# EAGLE design MCP1700 (EAGLE 7.1.0)
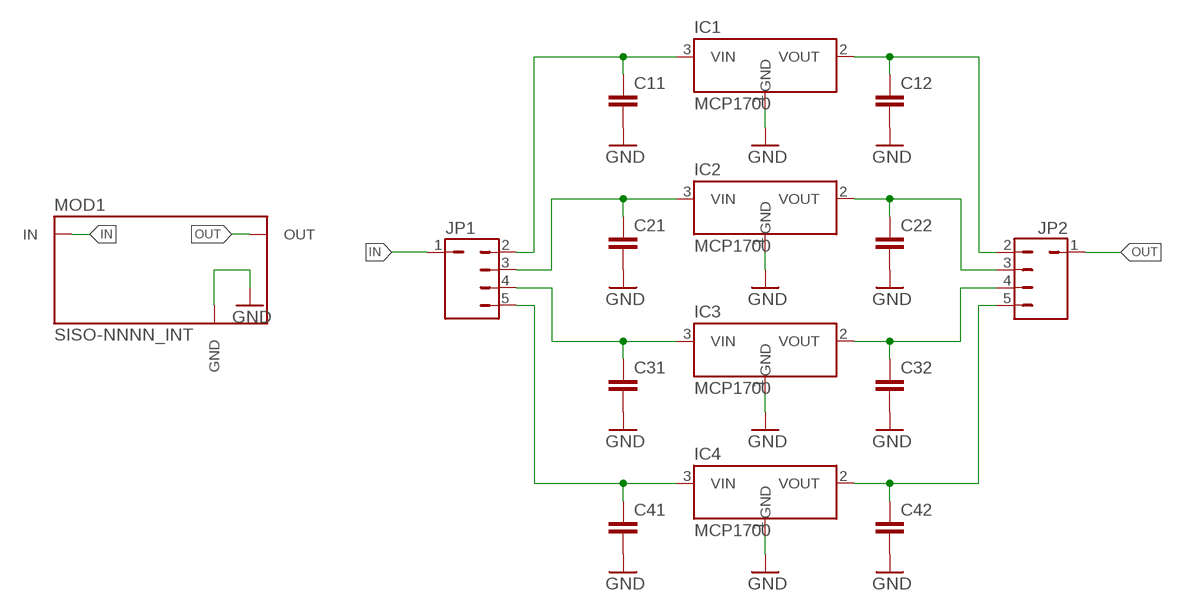
[diagram p0: schematic, sheet 1]

## Parts
C11  C-EUC0805  [C0805]
C12  C-EUC0805  [C0805]
C21  C-EUC0805  [C0805]
C22  C-EUC0805  [C0805]
C31  C-EUC0805  [C0805]
C32  C-EUC0805  [C0805]
C41  C-EUC0805  [C0805]
C42  C-EUC0805  [C0805]
IC1  MCP1700  [SOT23]
IC2  MCP1700  [SOT23]
IC3  MCP1700  [SOT23]
IC4  MCP1700  [SOT23]
JP1  JP4Q  [JP1-4]
JP2  JP4Q  [JP1-4]
MOD1  SISO-NNNN_INT  [SISO-NNNN]

## Nets
GND: C11.2 C12.2 C21.2 C22.2 C31.2 C32.2 C41.2 C42.2 IC1.1(GND) IC2.1(GND) IC3.1(GND) IC4.1(GND) MOD1.GND1(GND) MOD1.GND2(GND) MOD1.GND3(GND) MOD1.GND4(GND)
IN: JP1.1 MOD1.IN1(IN) MOD1.IN2(IN) MOD1.IN3(IN) MOD1.IN4(IN)
N$1: C11.1 IC1.3(VIN) JP1.2
N$2: C21.1 IC2.3(VIN) JP1.3
N$3: C31.1 IC3.3(VIN) JP1.4
N$4: C41.1 IC4.3(VIN) JP1.5
N$5: C12.1 IC1.2(VOUT) JP2.2
N$6: C22.1 IC2.2(VOUT) JP2.3
N$7: C32.1 IC3.2(VOUT) JP2.4
N$8: C42.1 IC4.2(VOUT) JP2.5
OUT: JP2.1 MOD1.OUT1(OUT) MOD1.OUT2(OUT) MOD1.OUT3(OUT) MOD1.OUT4(OUT)

## Library data of the parts
C11 C12 C21 C22 C31 C32 C41 C42 = rcl:C-EU: CAPACITOR, European symbol
IC1-IC4 = MCP1700:MCP1700
JP1 JP2 = Jumper_mod:JP4Q: JUMPER
MOD1 = AllModules:SISO-NNNN_INT

## Board
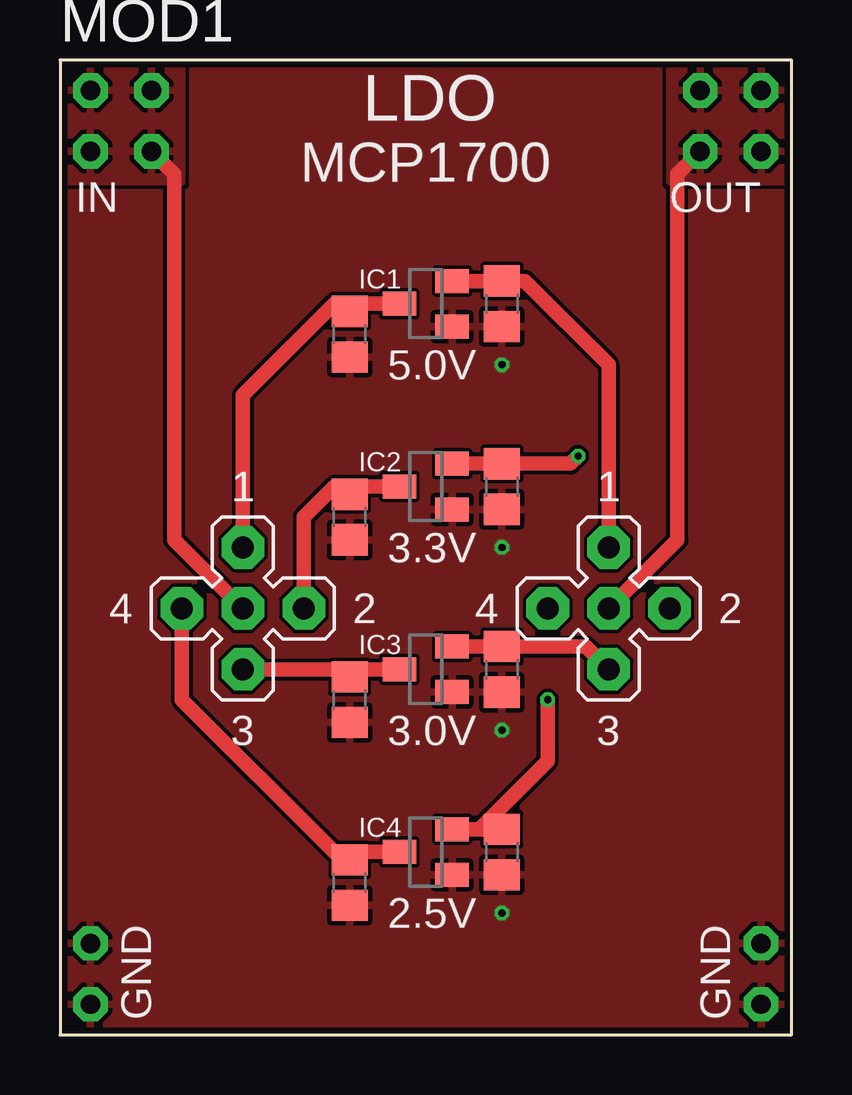
[diagram p1: board, top side]
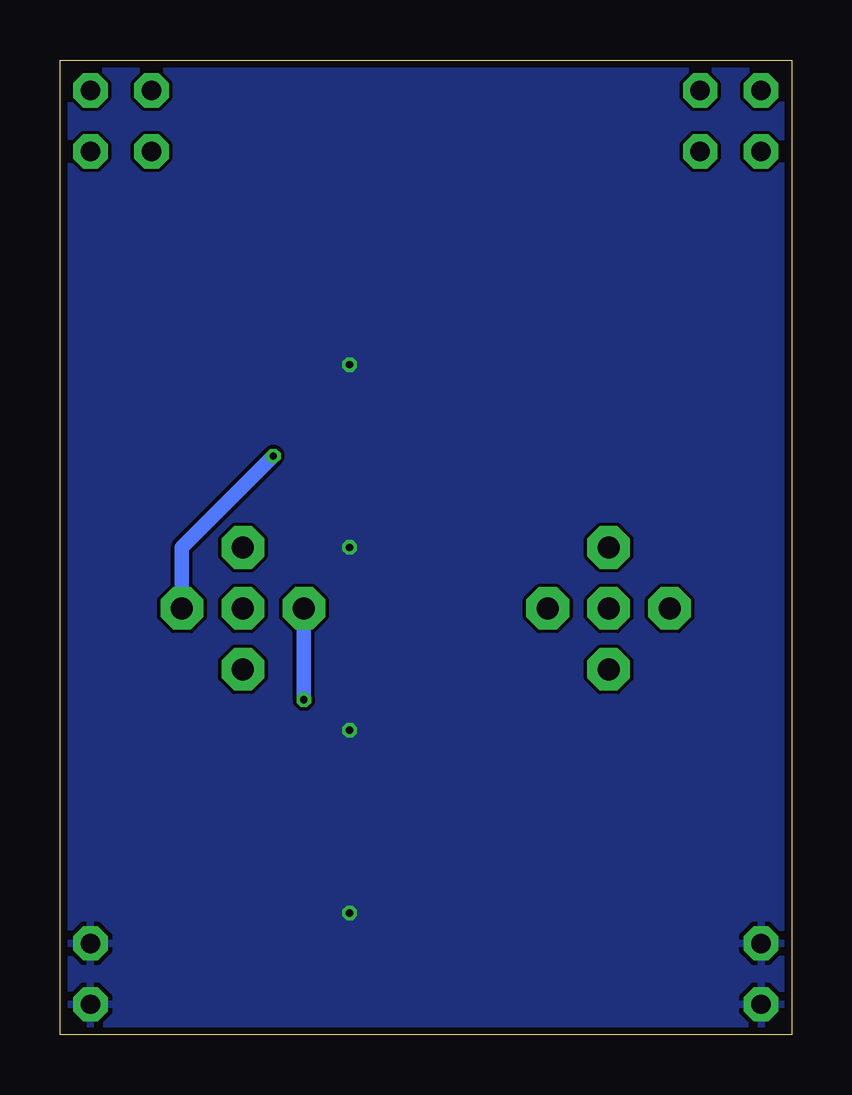
[diagram p2: board, bottom side, seen from below]

Size 30.48 x 40.64 mm. Coordinates in mm from the lower left corner, seen from the top.
Outline: 0,0 30.48,0 30.48,40.64 0,40.64 0,0
Copper layers (1*16): Top 0.035mm / dielectric 1.5mm / Bottom 0.035mm
Design rules "PCB-POOL Standard *": minimum track width 0.15mm, minimum drill 0.3mm, track to track 0.15mm, track to pad 0.15mm, pad to pad 0.15mm, via to via 0.15mm, smd to smd 0.15mm, copper to edge 0.3mm, drill to drill 0.2mm, minimum pad ring 0.2mm, minimum via ring 0.15mm, stop-mask expansion 0.075mm, vias tented up to drill 0mil, thermal gap 0.2mm

### Footprints (pad centres in the part's own frame; a part is rotated, then mirrored left to right if it is on the bottom)
C0805 = smd 1.3 x 1.5: 1 -0.95,0; 2 0.95,0
SOT23 = smd 1 x 1.4: 1 -0.95,-1.1; 2 0.95,-1.1; 3 0,1.1
JP1-4 = drill 0.914 pad 1.778 octagon: 1 0,0; 2 0,2.54; 3 2.54,0; 4 0,-2.54; 5 -2.54,0
SISO-NNNN = drill 0.8 pad 1.422 octagon: GND1 0,-38.1; GND2 0,-35.56; GND3 27.94,-35.56; GND4 27.94,-38.1; IN1 0,0; IN2 0,-2.54; IN3 2.54,0; IN4 2.54,-2.54; OUT1 25.4,0; OUT2 25.4,-2.54; OUT3 27.94,0; OUT4 27.94,-2.54

### Placement (x,y rotation side)
C11  12.06,29.21 270 top
C12  18.41,30.48 270 top
C21  12.06,21.59 270 top
C22  18.41,22.86 270 top
C31  12.06,13.97 270 top
C32  18.41,15.24 270 top
C41  12.06,6.35 270 top
C42  18.41,7.62 270 top
IC1  15.24,30.48 90 top
IC2  15.24,22.86 90 top
IC3  15.24,15.24 90 top
IC4  15.24,7.62 90 top
JP1  7.62,17.78 0 top
JP2  22.86,17.78 0 top
MOD1  1.27,39.37 0 top

### Tracks (layer width: path | path; a pad name or v marks a point on that pad's centre or on a via)
GND  (via drill 0.3)
  other vias: 18.41,27.94 18.41,20.32 18.41,12.7 18.41,5.08
  pour Bottom (rank 2): -0.64,41.27 31.11,41.27 31.11,-0.63 -0.64,-0.63
  pour Top (rank 2): -1.27,41.91 31.75,41.91 31.75,-1.27 -1.27,-1.27
IN
  Top 0.61: MOD1.IN4 4.76,35.88 4.76,20.64 JP1.1
  pour Top: 0,40.64 5.08,40.64 5.08,35.56 0,35.56
N$1
  Top 0.61: IC1.3 11.43,30.48 | 11.43,30.48 7.62,26.67 JP1.2 | 11.43,30.48 11.75,30.16 C11.1
N$2
  Top 0.61: IC2.3 11.43,22.86 | 11.43,22.86 10.16,21.59 JP1.3 | 11.43,22.86 11.75,22.54 C21.1
N$3
  Top 0.61: JP1.4 IC3.3 12.38,15.24 C31.1
N$4
  Top 0.61: JP1.5 5.08,13.97 11.43,7.62 | 11.43,7.62 IC4.3 | 11.43,7.62 11.75,7.3 C41.1
N$5
  Top 0.61: IC1.2 C12.1 19.05,31.43 19.37,31.43 22.86,27.94 JP2.2
N$6  (via drill 0.3)
  Top 0.61: v21.59,24.13 21.27,23.81 C22.1 IC2.2
  Bottom 0.61: JP2.3 25.4,20.32 v21.59,24.13
N$7
  Top 0.61: IC3.2 17.14,16.19 C32.1 21.91,16.19 JP2.4
N$8  (via drill 0.3)
  Top 0.61: IC4.2 17.14,8.57 17.46,8.57 | 17.46,8.57 20.32,11.43 v20.32,13.97 | C42.1 17.46,8.57
  Bottom 0.61: v20.32,13.97 JP2.5
OUT
  Top 0.61: MOD1.OUT2 25.72,35.88 25.72,20.64 JP2.1
  pour Top: 25.4,40.64 30.48,40.64 30.48,35.56 25.4,35.56

### Text on the board
tNames: LDO | MCP1700 | 5.0V | 1 | 1 | 3.3V | 4 | 2 | 4 | 2 | 3 | 3.0V | 3 | 2.5V
bStop: by Kokert & Beckedahl / 25.04.2017